# Altium schematic sheet HashPower3.SchDoc: ANT_Miner_V1.3
size A4; Date: 2013/11/20; DrawnBy: Bitmain Technology; SheetNumber: 4; SheetTotal: 9
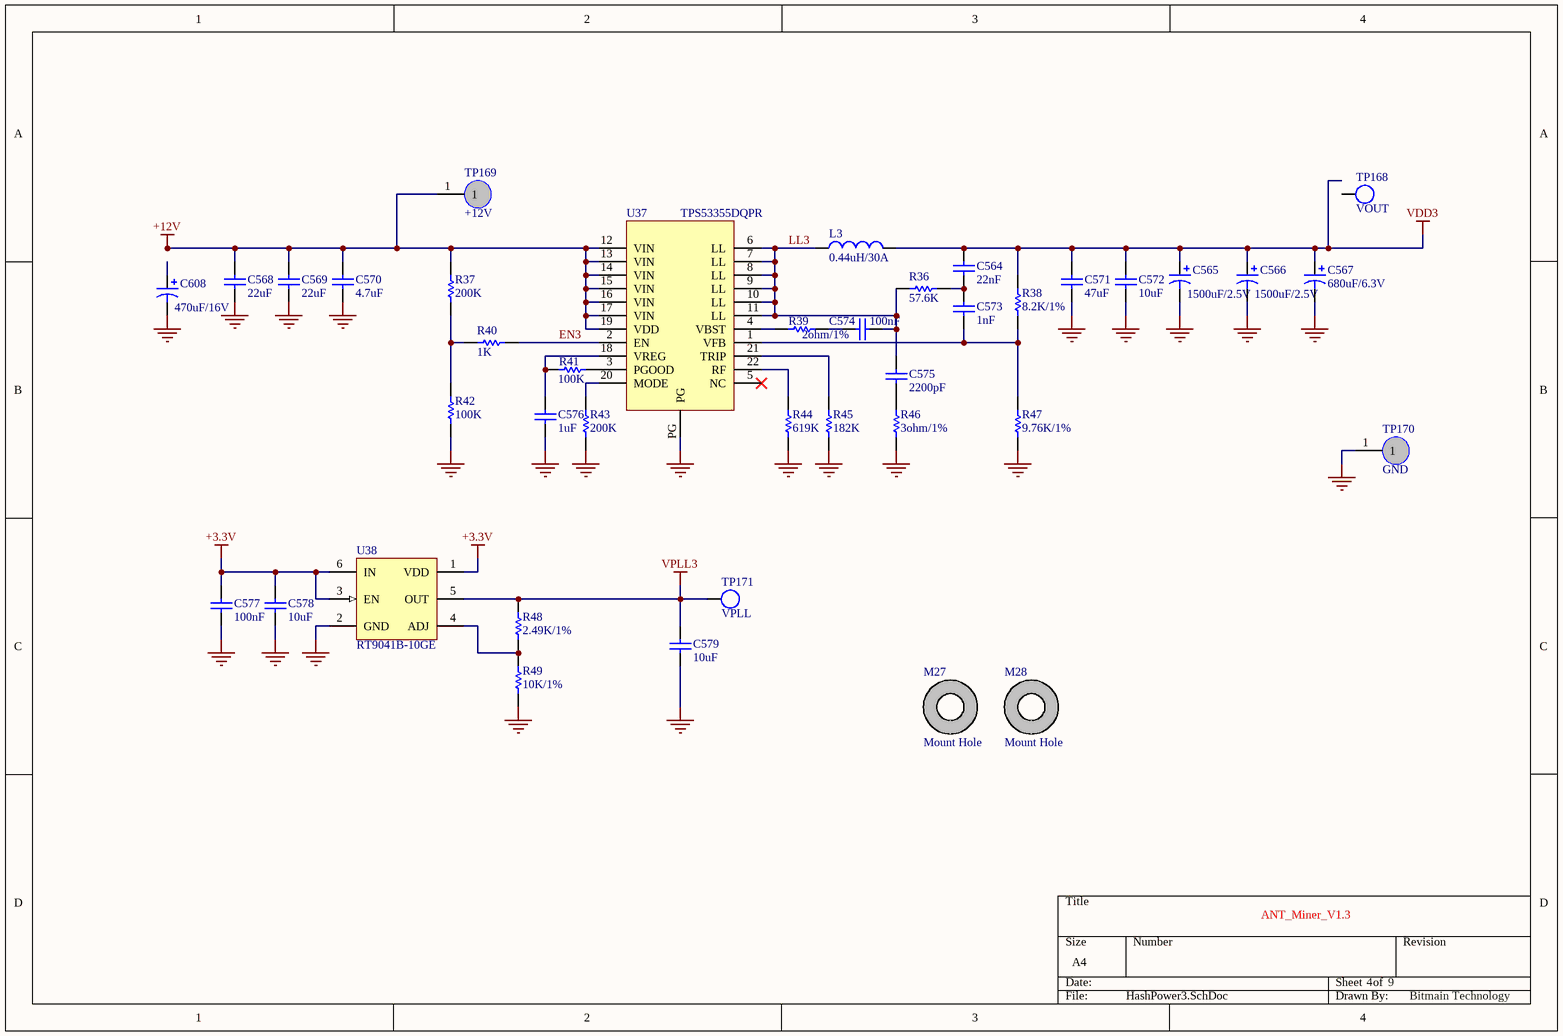
[diagram p0: HashPower3.SchDoc]

## Parts
C564  22nF  [CC0603(1608)]
C565  value 1500uF/2.5V  [F12]  (hidden comment: 1500uF/4V)
C566  value 1500uF/2.5V  [F12]  (hidden comment: 1500uF/4V)
C567  680uF/6.3V  [D]
C568  22uF  [CC1210(3225)]
C569  22uF  [CC1210(3225)]
C570  4.7uF  [CC0805(2012)]
C571  47uF  [CAPC3225L]
C572  10uF  [CAPC2012L]
C573  1nF  [CC0603(1608)]
C574  100nF  [CC0603(1608)]
C575  2200pF  [CC0603(1608)]
C576  1uF  [CC0603(1608)]
C577  100nF  [CC0603(1608)]
C578  10uF  [CC0805(2012)]
C579  10uF  [CC0805(2012)]
C608  470uF/16V  [E12]
L3  0.44uH/30A  [IHLP5050]
M27  Mount Hole  [HOLE_3.2]
M28  Mount Hole  [HOLE_3.2]
R36  57.6K  [RR0603(1608)]
R37  200K  [RR0603(1608)]
R38  8.2K/1%  [RR0603(1608)]
R39  value 2ohm/1%  [RR0603(1608)]  (hidden comment: 2)
R40  1K  [RR0603(1608)]
R41  100K  [RR0603(1608)]
R42  100K  [RR0603(1608)]
R43  200K  [RR0603(1608)]
R44  619K  [RR0603(1608)]
R45  182K  [RR0603(1608)]
R46  value 3ohm/1%  [RR0603(1608)]  (hidden comment: 3)
R47  9.76K/1%  [RR0603(1608)]
R48  2.49K/1%  [RR0603(1608)]
R49  10K/1%  [RR0603(1608)]
TP168  VOUT  [TP_SMD_1.0]
TP169  +12V  [TP]
TP170  GND  [TP]
TP171  VPLL  [TP_SMD_1.0]
U37  TPS53355DQPR  [TPS53355]
U38  RT9041B-10GE  [SOT23-6_L]

## Nets
+3.3V: C577.2 C578.2 U38.1(VDD) U38.3(EN) U38.6(IN)
+12V: C568.1 C569.1 C570.1 R37.1 TP169.1 U37.12(VIN) U37.13(VIN) U37.14(VIN) U37.15(VIN) U37.16(VIN) U37.17(VIN) U37.19(VDD)
GND: C565.2 C566.2 C567.2 C568.2 C569.2 C570.2 C571.1 C572.1 C576.2 C577.1 C578.1 C579.1 C608.2 R42.2 R43.2 R44.2 R45.2 R46.2 R47.2 R49.1 TP170.1 U37.PG U38.2(GND)
VDD3: C564.1 C565.1 C566.1 C567.1 C571.2 C572.2 L3.2 R38.1
VPLL3: C579.2 R48.2 TP171.1 U38.5(OUT)
EN3: R40.2 U37.2(EN)
LL3: C574.2 C575.1 L3.1 R36.1 U37.6(LL) U37.7(LL) U37.8(LL) U37.9(LL) U37.10(LL) U37.11(LL)
NetC564_2: C564.2 C573.1 R36.2
NetC573_2: C573.2 R38.2 R47.1 U37.1(VFB)
NetC574_1: C574.1 R39.2
NetC575_2: C575.2 R46.1
NetC576_1: C576.1 R41.1 U37.18(VREG)
NetR37_2: R37.2 R40.1 R42.1
NetR39_1: R39.1 U37.4(VBST)
NetR41_2: R41.2 U37.3(PGOOD)
NetR43_1: R43.1 U37.20(MODE)
NetR44_1: R44.1 U37.22(RF)
NetR45_1: R45.1 U37.21(TRIP)
NetR48_1: R48.1 R49.2 U38.4(ADJ)

Not connected (* = marked no-connect by the designer): C608 1; M27 0(PIN); M28 0(PIN); TP168 1; U37 5(NC)*

## Library data of the parts
C564 C568-C570 C573-C576 = Cap: Capacitor
  C564: Value: 22nF
  C568 C569: Value: 22uF
  C570: Value: 4.7uF
  C573: Value: 1nF
  C574: Value: 100nF
  C575: Value: 2200pF
  C576: Value: 1uF
C565 C566 C608 = Cap Pol2: Polarized Capacitor (SMD)
  C608: Value: 470uF/16V
C567 = Cap Pol3: Polarized Capacitor (Surface Mount); Published: 8-Jun-2000; LatestRevisionDate: 29-May-2009; LatestRevisionNote: IPC-7351 Footprint Added.; PackageReference: C0805; Publisher: Altium Limited; PackageDescription: Chip Capacitor; Value: 680uF/6.3V
C571 C572 C577-C579 = Cap Semi: Capacitor (Semiconductor SIM Model); Published: 8-Jun-2000; LatestRevisionDate: 29-May-2009; LatestRevisionNote: IPC-7351 Footprint Added.; PackageReference: C1206; Publisher: Altium Limited; PackageDescription: Chip Capacitor
  C571: Value: 47uF
  C572 C578 C579: Value: 10uF
  C577: Value: 100nF
L3 = Inductor: Code_IEC: 1005; Published: 8-Jun-2000; LatestRevisionDate: 29-May-2009; LatestRevisionNote: IPC-7351 Footprint Added.; PackageReference: 0402-A; Publisher: Altium Limited; PackageDescription: Chip Inductor; Code_JEITA: 0402; Value: 0.44uH/30A
M27 M28 = M_Hole
R36-R49 = Res1: Resistor
  R36: Value: 57.6K
  R37 R43: Value: 200K
  R38: Value: 8.2K/1%
  R40: Value: 1K
  R41 R42: Value: 100K
  R44: Value: 619K
  R45: Value: 182K
  R47: Value: 9.76K/1%
  R48: Published: 8-Jun-2000; LatestRevisionDate: 17-Jul-2002; LatestRevisionNote: Re-released for DXP Platform.; PackageReference: AXIAL-0.3; Publisher: Altium Limited; PackageDescription: Axial Device, Thru-Hole; 2 Leads; 0.3 in Pin Spacing; Value: 2.49K/1%
  R49: Published: 8-Jun-2000; LatestRevisionDate: 17-Jul-2002; LatestRevisionNote: Re-released for DXP Platform.; PackageReference: AXIAL-0.3; Publisher: Altium Limited; PackageDescription: Axial Device, Thru-Hole; 2 Leads; 0.3 in Pin Spacing; Value: 10K/1%
TP168 TP171 = TP: Test Point
  TP168: Value: VOUT
  TP171: Value: VPLL
TP169 TP170 = TP
U37 = TPS53355